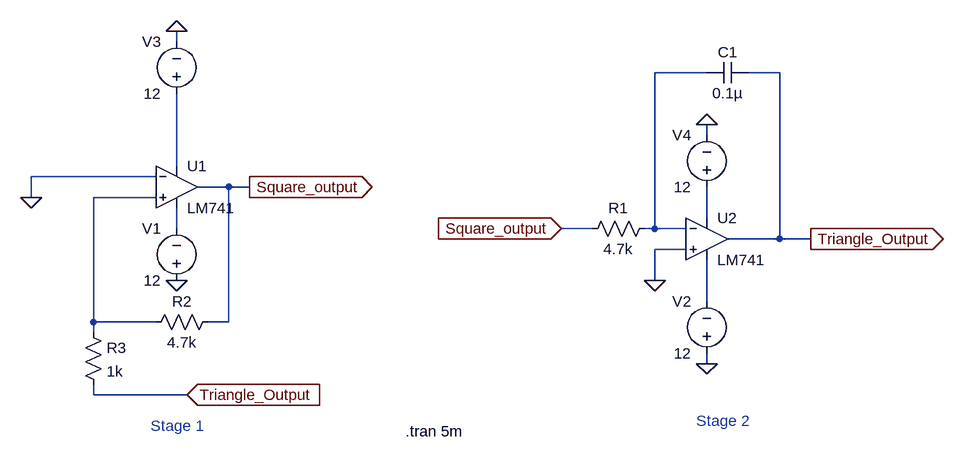
[diagram p0: schematic FINAL_CIRCUIT.asc]
FINAL_CIRCUIT.asc, the LTspice schematic file:
Version 4
SHEET 1 1136 720
WIRE -144 -144 -144 -160
WIRE 672 -96 592 -96
WIRE 784 -96 736 -96
WIRE 672 0 672 -16
WIRE -144 48 -144 -64
WIRE -176 64 -368 64
WIRE -64 80 -112 80
WIRE -32 80 -64 80
WIRE -368 96 -368 64
WIRE -176 96 -272 96
WIRE 672 128 672 80
WIRE -144 144 -144 112
WIRE 496 144 448 144
WIRE 592 144 592 -96
WIRE 592 144 576 144
WIRE 640 144 592 144
WIRE 784 160 784 -96
WIRE 784 160 704 160
WIRE 832 160 784 160
WIRE 640 176 592 176
WIRE 592 224 592 176
WIRE 672 256 672 192
WIRE -272 288 -272 96
WIRE -176 288 -272 288
WIRE -64 288 -64 80
WIRE -64 288 -96 288
WIRE -272 304 -272 288
WIRE 672 352 672 336
WIRE -272 400 -272 384
WIRE -128 400 -272 400
FLAG -368 96 0
FLAG -144 224 0
FLAG 672 352 0
FLAG -144 -160 0
FLAG 672 -16 0
FLAG 592 224 0
FLAG -32 80 Square_output
IOPIN -32 80 Out
FLAG 448 144 Square_output
IOPIN 448 144 In
FLAG 832 160 Triangle_Output
IOPIN 832 160 Out
FLAG -128 400 Triangle_Output
IOPIN -128 400 In
SYMBOL Opamps\\LM741 -144 16 R0
SYMATTR InstName U1
SYMBOL Opamps\\LM741 672 96 R0
SYMATTR InstName U2
SYMBOL res 592 128 R90
WINDOW 0 0 56 VBottom 2
WINDOW 3 32 56 VTop 2
SYMATTR InstName R1
SYMATTR Value 4.7k
SYMBOL res -80 272 R90
WINDOW 0 0 56 VBottom 2
WINDOW 3 32 56 VTop 2
SYMATTR InstName R2
SYMATTR Value 4.7k
SYMBOL res -288 288 R0
SYMATTR InstName R3
SYMATTR Value 1k
SYMBOL cap 736 -112 R90
WINDOW 0 0 32 VBottom 2
WINDOW 3 32 32 VTop 2
SYMATTR InstName C1
SYMATTR Value 0.1µ
SYMBOL voltage -144 240 R180
WINDOW 0 24 96 Left 2
WINDOW 3 24 16 Left 2
WINDOW 123 0 0 Left 2
WINDOW 39 0 0 Left 2
SYMATTR InstName V1
SYMATTR Value 12
SYMBOL voltage 672 352 R180
WINDOW 0 24 96 Left 2
WINDOW 3 24 16 Left 2
WINDOW 123 0 0 Left 2
WINDOW 39 0 0 Left 2
SYMATTR InstName V2
SYMATTR Value 12
SYMBOL voltage -144 -48 R180
WINDOW 0 24 96 Left 2
WINDOW 3 24 16 Left 2
WINDOW 123 0 0 Left 2
WINDOW 39 0 0 Left 2
SYMATTR InstName V3
SYMATTR Value 12
SYMBOL voltage 672 96 R180
WINDOW 0 24 96 Left 2
WINDOW 3 24 16 Left 2
WINDOW 123 0 0 Left 2
WINDOW 39 0 0 Left 2
SYMATTR InstName V4
SYMATTR Value 12
TEXT 208 456 Left 2 !.tran 5m
TEXT -184 448 Left 2 ;Stage 1
TEXT 656 440 Left 2 ;Stage 2

The netlist it stands for:
* FINAL_CIRCUIT.asc
XU1 N003 0 N002 N005 Square_output LM741  ; pins In+ In- V+ V- OUT
XU2 0 N001 N004 N006 Triangle_Output LM741  ; pins In+ In- V+ V- OUT
R1 N001 Square_output 4.7k
R2 Square_output N003 4.7k
R3 N003 Triangle_Output 1k
C1 Triangle_Output N001 0.1µ
V1 0 N005 12
V2 0 N006 12
V3 N002 0 12
V4 N004 0 12
.tran 5m
* Stage 1
* Stage 2
.lib LM741.lib
.backanno
.end